# EasyEDA Pro project USB一拖四集线器.eprj

# Schematic USB集线器V1.0
Board Name: USB集线器V1.0; Create Date: 2025-10-13; Page Name: USB集线器V1.0; Project Name: 基于SL2.1A  USB一拖四集线器（已验证）; Schematic Name: USB集线器V1.0; Update Date: 2025-10-13; Company: 嘉立创EDA; Page Size: A4; Version: V1.0
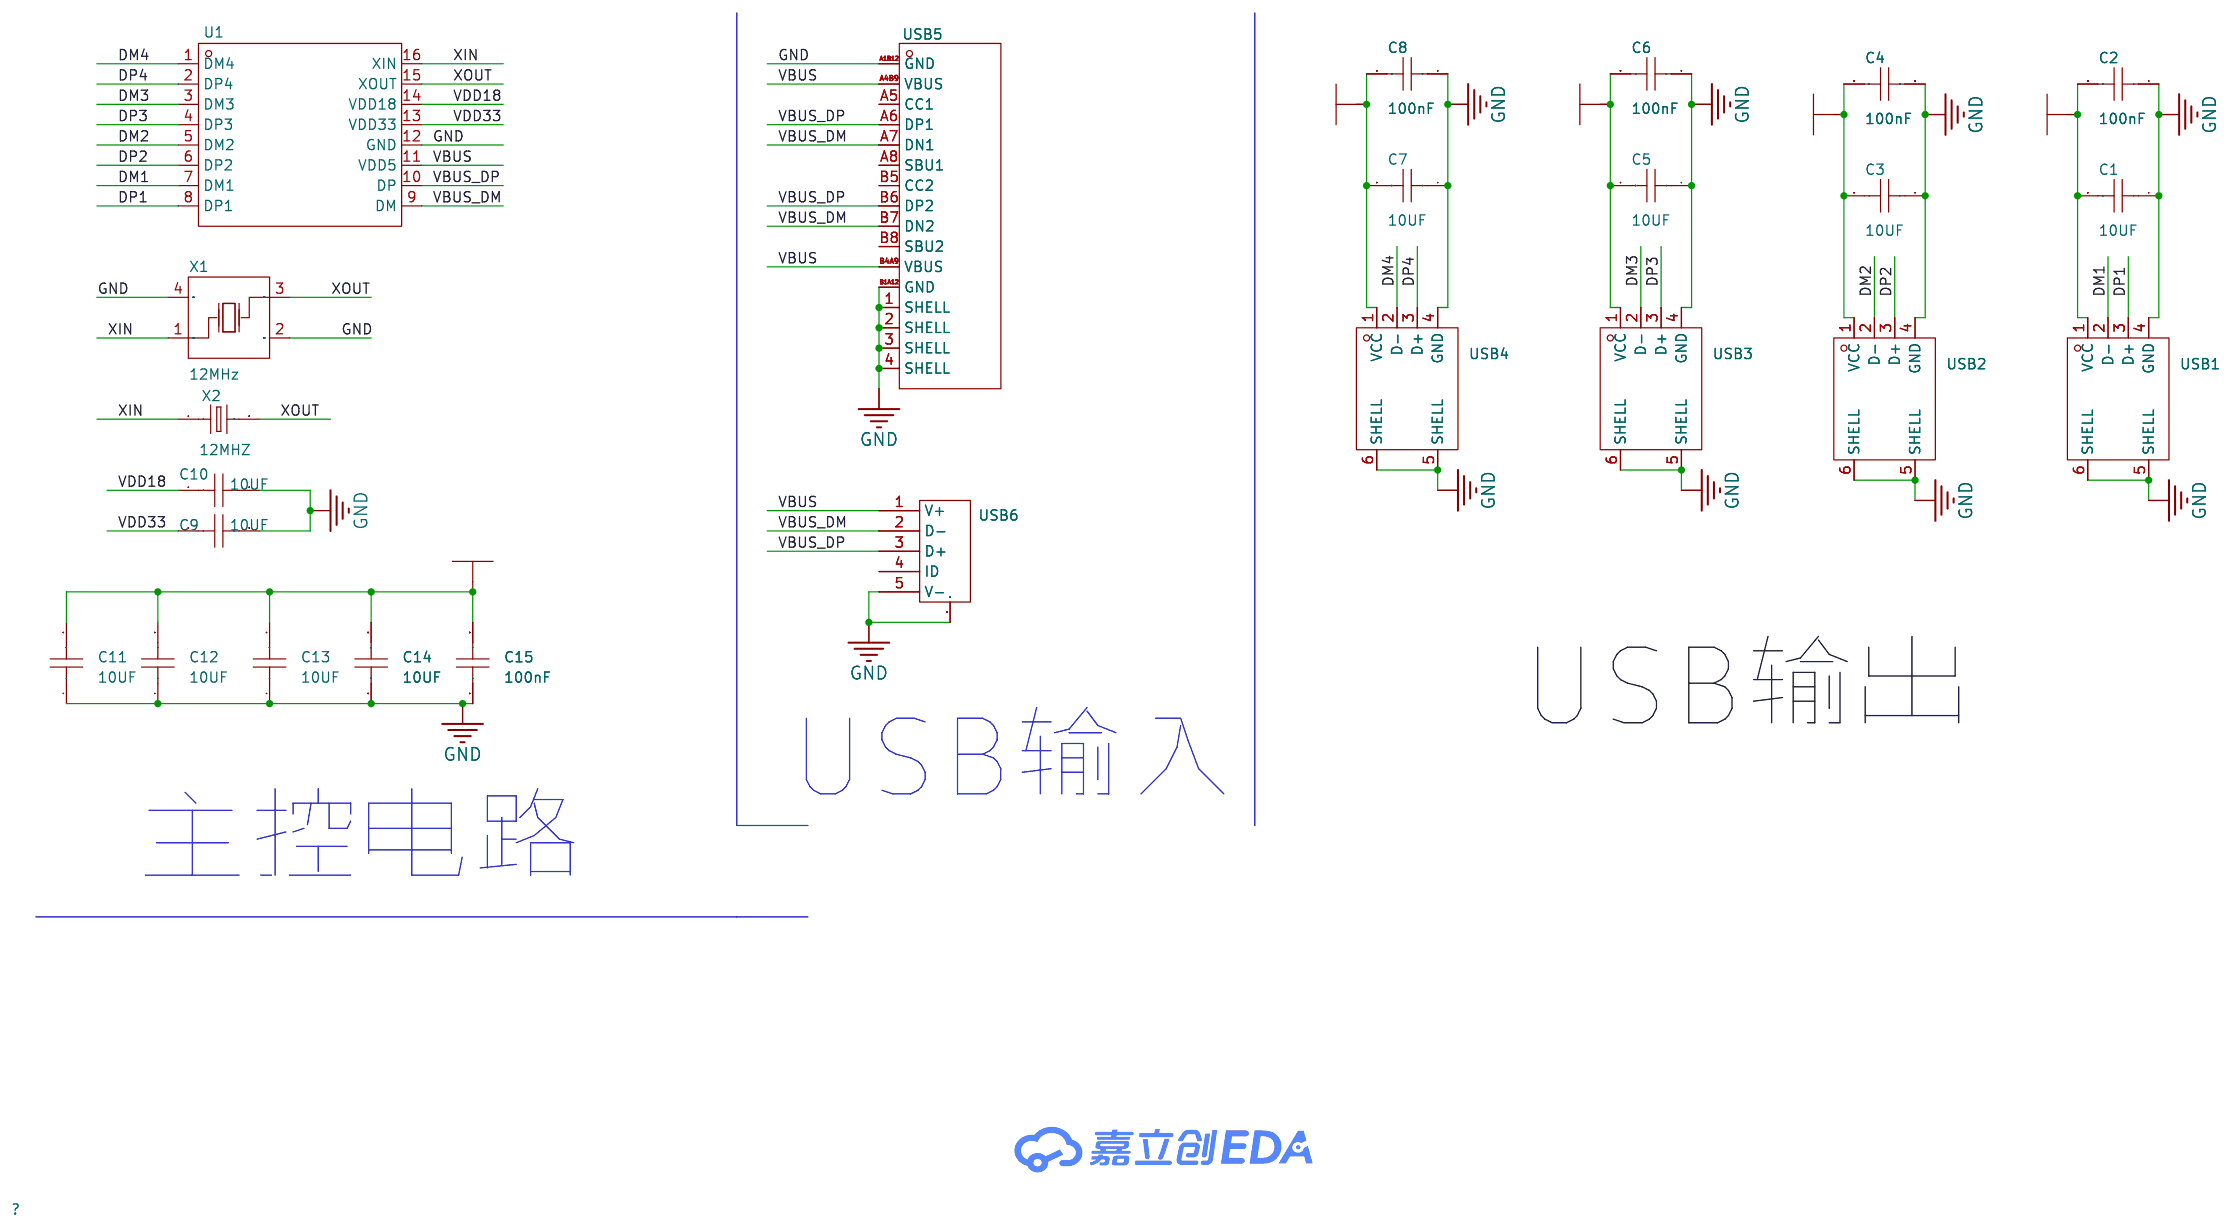
[diagram p0: schematic sheet]

## Parts
C1  10UF  [C0805]
C2  100nF  [C0805]
C3  10UF  [C0805]
C4  100nF  [C0805]
C5  10UF  [C0805]
C6  100nF  [C0805]
C7  10UF  [C0805]
C8  100nF  [C0805]
C9  10UF  [C0805]
C10  10UF  [C0805]
C11  10UF  [C0805]
C12  10UF  [C0805]
C13  10UF  [C0805]
C14  10UF  [C0805]
C15  100nF  [C0805]
U1  -  [SOP-16_L10.0-W3.9-P1.27-LS6.0-BL]
USB1  -  [USB-A-TH_916-362A1114Y10210]
USB2  -  [USB-A-TH_916-362A1114Y10210]
USB3  -  [USB-A-TH_916-362A1114Y10210]
USB4  -  [USB-A-TH_916-362A1114Y10210]
USB5  -  [USB-C-SMD_TYPE-C16PIN]
USB6  -  [MICRO-USB-SMD_5P-P0.65-H-F_C10418]
X1  12MHz  [OSC-SMD_4P-L3.2-W2.5-BL]
X2  12MHZ  [HC-49US_L11.5-W4.5-P4.88]

## Library data of the parts
C1-C15 = C_0805_US: 容值:100nF;精度:±10%;额定电压:50V;温度系数:X7R;; Supplier Footprint: 0805
U1 = SL2.1A: 类型:-;协议类别:-;驱动器/接收器数:-;数据速率:-;; Supplier Part: C192893; Manufacturer: CoreChips(和芯润德); Supplier Footprint: SOP-16_150mil; JLCPCB Part Class: Extended Part; Datasheet: https://atta.szlcsc.com/upload/public/pdf/source/20180522/C192893_624110D24898D57AAC785E3DF98EA862.pdf; Supplier: LCSC
USB1-USB4 = 916-362A1094Y10210: 连接器类型:Type-A;标准:USB 2.0;公母:母座;触点数量:4;端口数量:1;安装方式:直插;额定电流 - 电源:5A;工作温度范围:-55~+85;; LCSC Part Name: Type-A 母座 直插 大电流短体鱼叉脚无边铜壳PBT绿色; Supplier Part: C2763359; Manufacturer: 精拓金; Supplier Footprint: 插件; JLCPCB Part Class: Extended Part; Datasheet: https://atta.szlcsc.com/upload/public/pdf/source/20210526/C2763359_93EC42E46267681D1445F62B8B521E70.pdf; Supplier: LCSC; Connector Type: Type-A; Standard: USB 2.0; Gender: 母座; Number of Contacts: 4; Number of Ports: 1; Mounting Style: 直插; Current Rating - Power (Max): 5A; Operating Temperature Range: -55~+85
USB5 = TYPE-C16PIN: 连接器类型:Type-C;标准:-;公母:母座;触点数量:16;端口数量:1;安装方式:卧贴;额定电流 - 电源:3A;工作温度范围:-40~+85;; LCSC Part Name: Type-C 母座 卧贴 快充闪充 停产; Supplier Part: C393939; Manufacturer: SHOU HAN(首韩); Supplier Footprint: SMD; JLCPCB Part Class: Extended Part; Datasheet: https://atta.szlcsc.com/upload/public/pdf/source/20190521/C393939_7B9043D4CF1026AF443AB60D91FBCD5C.pdf; Supplier: LCSC; Connector Type: Type-C; Gender: 母座; Number of Contacts: 16; Number of Ports: 1; Mounting Style: 卧贴; Current Rating - Power (Max): 3A; Operating Temperature Range: -40~+85
USB6 = 920-E52A2021S10100: 连接器类型:Micro-B;标准:USB 2.0;公母:母座;触点数量:5;端口数量:1;额定电流 - 电源:1A;; LCSC Part Name: Micro-B 母座; Supplier Part: C10418; Manufacturer: 精拓金; Supplier Footprint: SMD; JLCPCB Part Class: Extended Part; Datasheet: https://atta.szlcsc.com/upload/public/pdf/source/20210305/C10418_4890444E73C7CF5EB311058F76E5ECA4.pdf; Supplier: LCSC; Connector Type: Micro-B; Standard: USB 2.0; Gender: 母座; Number of Contacts: 5; Number of Ports: 1; Current Rating - Power (Max): 1A
X1 = X322516MLB4SI: 晶振类型:贴片无源晶振;频率:16MHz;频率公差:±10ppm;频率稳定度:±30ppm;负载电容:9pF;工作温度:-40~+85;; LCSC Part Name: 16MHz ±10ppm 9pF; Supplier Part: C13738; Manufacturer: YXC扬兴科技; Supplier Footprint: SMD3225-4P; JLCPCB Part Class: Basic Part; Datasheet: https://atta.szlcsc.com/upload/public/pdf/source/20210329/C112971_1F611BDC486E193C1706F6D8EB5AA189.pdf; Supplier: LCSC; Crystal Type: 贴片无源晶振; Frequency Tolerance: ±10ppm; Frequency Stability: ±30ppm; Load Capacitance: 9pF; Operating Temperature: -40~+85
X2 = XIHCELNANF-12MHZ: 晶振类型:-;频率:-;频率公差:-;频率稳定度:-;负载电容:-;工作温度:-;; LCSC Part Name: 12MHZ 20PF30PPM -40~+85DIP; Supplier Part: C295072; Manufacturer: TAITIEN(泰艺电子); Supplier Footprint: HC-49S; JLCPCB Part Class: Extended Part; Datasheet: https://atta.szlcsc.com/upload/public/pdf/source/20180928/C295072_40A8829C49447BBE93E34C1F24014779.pdf; Supplier: LCSC

## Nets
GND: C1.1 C2.1 C3.1 C4.1 C5.1 C6.1 C7.1 C8.1 C9.2 C10.2 C11.1 C12.1 C13.1 C14.1 C15.1 U1.12(GND) USB1.4(GND) USB1.5(SHELL) USB1.6(SHELL) USB2.4(GND) USB2.5(SHELL) USB2.6(SHELL) USB3.4(GND) USB3.5(SHELL) USB3.6(SHELL) USB4.4(GND) USB4.5(SHELL) USB4.6(SHELL) USB5.1(SHELL) USB5.2(SHELL) USB5.3(SHELL) USB5.4(SHELL) USB5.A1B12(GND) USB5.B1A12(GND) USB6.0(MTN) USB6.5(V-) X1.2(GND) X1.4(GND)
VBUS: C1.2 C2.2 C3.2 C4.2 C5.2 C6.2 C7.2 C8.2 C11.2 C12.2 C13.2 C14.2 C15.2 U1.11(VDD5) USB1.1(VCC) USB2.1(VCC) USB3.1(VCC) USB4.1(VCC) USB5.A4B9(VBUS) USB5.B4A9(VBUS) USB6.1(V+)
VBUS_DM: U1.9(DM) USB5.A7(DN1) USB5.B7(DN2) USB6.2(D-)
VBUS_DP: U1.10(DP) USB5.A6(DP1) USB5.B6(DP2) USB6.3(D+)
VDD18: C10.1 U1.14(VDD18)
VDD33: C9.1 U1.13(VDD33)
DM1: U1.7(DM1) USB1.2(D-)
DM2: U1.5(DM2) USB2.2(D-)
DM3: U1.3(DM3) USB3.2(D-)
DM4: U1.1(DM4) USB4.2(D-)
DP1: U1.8(DP1) USB1.3(D+)
DP2: U1.6(DP2) USB2.3(D+)
DP3: U1.4(DP3) USB3.3(D+)
DP4: U1.2(DP4) USB4.3(D+)
XIN: U1.16(XIN) X1.1(OSC1) X2.1
XOUT: U1.15(XOUT) X1.3(OSC2) X2.2

Not connected (* = marked no-connect by the designer): USB5 A5(CC1) A8(SBU1) B5(CC2) B8(SBU2); USB6 4(ID)

## Notes on the sheet
- USB输出
- USB输入
- 主控电路

# Board USB集线器V1.0
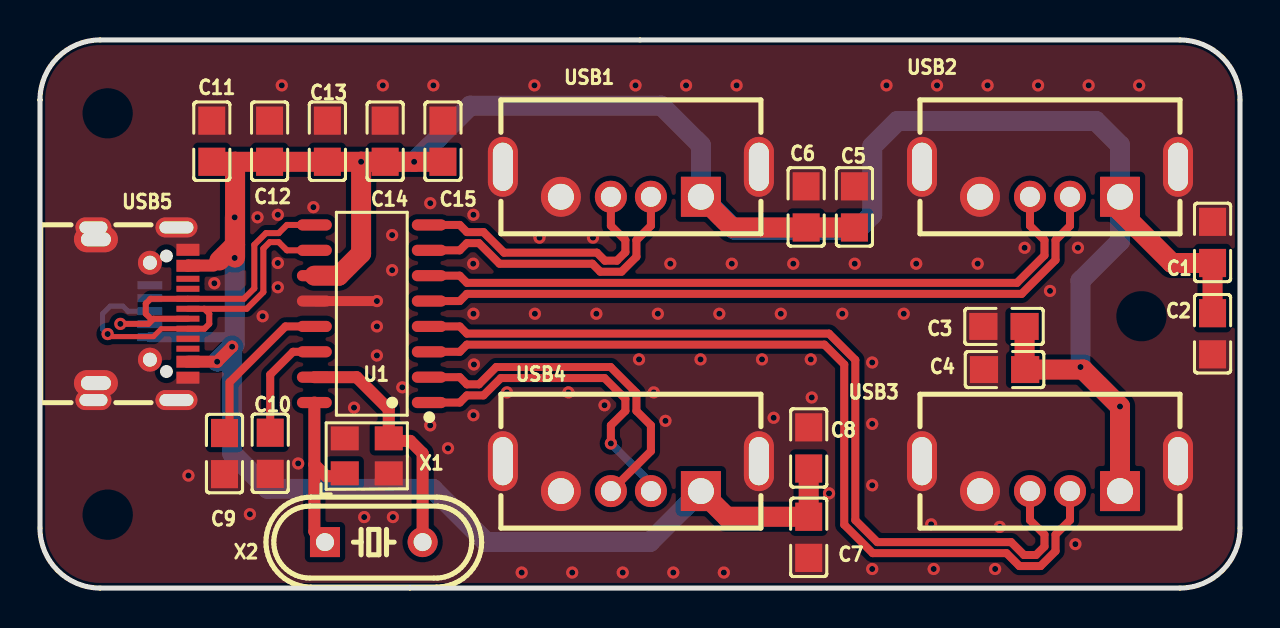
[diagram p1: board, top side]
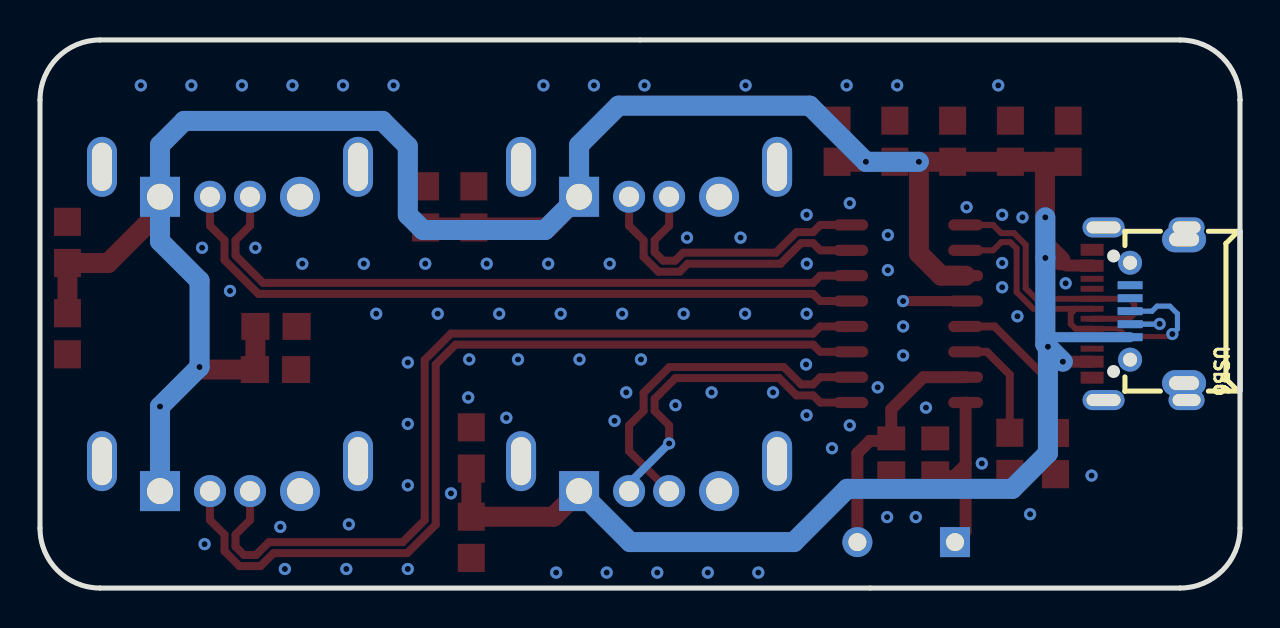
[diagram p2: board, bottom side, seen from below]

Outline 60 x 27.43 mm; copper layers: Top Layer, Bottom Layer. Coordinates in mm from the lower left corner of the outline.
Outline path: 0,3 0,24.43 arc(0.88,26.55) 3,27.43 57,27.43 arc(59.12,26.55) 60,24.43 60,3 arc(59.12,0.88) 57,0 3,0 arc(0.88,0.88) 0,3
Stack: Top Layer 0.035mm / Dielectric1 1.51mm FR4 er 4.5 / Bottom Layer 0.035mm

## Design rules (mm)
net DM4: DP4
net DP4: DP4
net DM3: DP3
net DP3: DP3
net DM2: DP2
net DP2: DP2
net DM1: DP1
net DP1: DP1
net XIN: DP6
net XOUT: DP6
net VBUS_DP: DP5
net VBUS_DM: DP5
spacing safeClearance (default): track to track 0.152, other pairs 0.152 to 0.3
track width trackWidth (default): min 0.127, default 0.254, max 2.54
differential pair differentialPair (default): width min 0.127, default 0.254, max 2.54; gap min 0.152, default 0.152
via viaSize (default): diameter min 0.5, default 0.61, max 10; hole min 0.3, default 0.305, max 6

## Placement (name value [footprint] x y rotation side)
C1  10UF  [C0805]  58.63 17.3 270 top
C2  100nF  [C0805]  58.63 12.73 90 top
C3  10UF  [C0805]  48.2 13.09 0 top
C4  100nF  [C0805]  48.23 10.94 0 top
C5  10UF  [C0805]  40.72 19.08 270 top
C6  100nF  [C0805]  38.31 19.08 270 top
C7  10UF  [C0805]  38.44 2.54 90 top
C8  100nF  [C0805]  38.44 7.01 270 top
C9  10UF  [C0805]  9.22 6.73 270 top
C10  10UF  [C0805]  11.51 6.74 270 top
C11  10UF  [C0805]  8.59 22.37 270 top
C12  10UF  [C0805]  11.48 22.37 270 top
C13  10UF  [C0805]  14.37 22.37 270 top
C14  10UF  [C0805]  17.26 22.37 270 top
C15  100nF  [C0805]  20.15 22.37 270 top
U1  -  [SOP-16_L10.0-W3.9-P1.27-LS6.0-BL]  16.59 13.73 90 top
USB1  -  [USB-A-TH_916-362A1114Y10210]  29.54 20.33 0 top
USB2  -  [USB-A-TH_916-362A1114Y10210]  50.5 20.33 0 top
USB3  -  [USB-A-TH_916-362A1114Y10210]  50.5 5.6 0 top
USB4  -  [USB-A-TH_916-362A1114Y10210]  29.54 5.6 0 top
USB5  -  [USB-C-SMD_TYPE-C16PIN]  5.03 13.73 270 top
USB6  -  [MICRO-USB-SMD_5P-P0.65-H-F_C10418]  4.14 13.86 90 bottom
X1  12MHz  [OSC-SMD_4P-L3.2-W2.5-BL]  16.34 6.62 0 top
X2  12MHZ  [HC-49US_L11.5-W4.5-P4.88]  16.69 2.3 0 top

## Footprints (pads in the part's own frame, mm; a bottom-side part is the same pattern mirrored in y, then rotated)
C0805
  rect 1.41x1.35 smd: 1(-1.03,0) 2(1.03,0)
HC-49US_L11.5-W4.5-P4.88
  rect 1.501x1.501 hole 0.899: 1(-2.441,0)
  round 1.501 hole 0.899: 2(2.441,0)
MICRO-USB-SMD_5P-P0.65-H-F_C10418
  oval 1.3x2.2 hole 0.701x1.501: 0(-3.599,-1.349) 0(3.599,-1.349)
  round 1.199 hole 0.701: 0(-2.425,1.351) 0(2.425,1.351)
  rect 0.399x1.25 smd: 1(-1.3,1.349) 2(-0.65,1.349) 3(0,1.349) 4(0.65,1.349) 5(1.3,1.349)
OSC-SMD_4P-L3.2-W2.5-BL
  rect 1.4x1.2 smd: 1(-1.1,-0.875) 2(1.1,-0.875) 3(1.1,0.875) 4(-1.1,0.875)
SOP-16_L10.0-W3.9-P1.27-LS6.0-BL
  oval 0.56x1.745 smd: 1(-4.445,-2.873) 2(-3.175,-2.873) 3(-1.905,-2.873) 4(-0.635,-2.873) 5(0.635,-2.873) 6(1.905,-2.873) 7(3.175,-2.873) 8(4.445,-2.873) 9(4.445,2.873) 10(3.175,2.873) 11(1.905,2.873) 12(0.635,2.873) 13(-0.635,2.873) 14(-1.905,2.873) 15(-3.175,2.873) 16(-4.445,2.873)
USB-A-TH_916-362A1114Y10210
  rect 1.999x1.999 hole 1.3: 1(3.5,-0.75)
  round 1.6 hole 1.001: 2(1.001,-0.75) 3(-1.001,-0.75)
  round 1.999 hole 1.3: 4(-3.5,-0.75)
  oval 1.501x2.999 hole 1.001x2.416: 5(6.401,0.75) 6(-6.401,0.75)
USB-C-SMD_TYPE-C16PIN
  oval 1.001x2.1 hole 0.6x1.7: 1(-4.321,1.788) 2(4.321,1.788)
  oval 1.001x1.801 hole 0.6x1.399: 3(-4.321,-2.362) 4(4.321,-2.362)
  rect 0.6x1.151 smd: A1B12(-3.2,2.362) A4B9(-2.401,2.362) B1A12(3.2,2.362) B4A9(2.401,2.362)
  rect 0.299x1.151 smd: A5(-1.25,2.362) A6(-0.249,2.362) A7(0.249,2.362) A8(-1.75,2.362) B5(1.75,2.362) B6(0.75,2.362) B7(-0.75,2.362) B8(1.25,2.362)

## Nets
As in the schematic.

Pads without a net: USB5 A5 A8 B5 B8; USB6 4

## Via types
v1: diameter 0.61, hole 0.305, Top Layer to Bottom Layer, 95 vias

## Routing (per net, layer and track width the routed paths; a pad name or vN(x,y) marks a point on that pad's centre or on a via; arc(x,y) is an arc through that point)
GND: length 3.1
  Top Layer w0.5: U1.12 v1(16.84,14.36)
  vias: v1(7.42,5.63) v1(8.72,15.25) v1(10.5,3.7) v1(10.88,18.56) v1(11.13,13.6) v1(11.89,18.68) v1(11.89,16.27) v1(11.89,15.05) v1(12.09,25.16) v1(12.91,6.24) v1(13.67,19.06) v1(15.7,9.03) v1(16.21,3.55) v1(16.84,13.09) v1(16.84,11.64) v1(17.14,25.16) v1(17.61,17.67) v1(17.61,15.91) v1(17.64,3.55) v1(18.11,10.05) v1(19.51,19.26) v1(19.51,8.14) v1(19.67,25.16) v1(20.4,7) v1(21.67,18.68) v1(21.66,16.23) v1(21.67,13.73) v1(21.67,8.65) v1(21.7,11.19) v1(23.35,9.79) v1(24.08,0.78) v1(24.72,25.16) v1(24.75,13.73) v1(24.97,17.54) v1(26.42,9.79) v1(26.61,0.78) v1(27.65,17.54) v1(27.82,13.73) v1(28.23,9.15) v1(29.14,0.78) v1(29.78,25.16) v1(29.95,11.44) v1(30.69,9.79) v1(30.89,13.73) v1(31.27,8.37) v1(31.52,16.23) v1(31.66,0.78) v1(32.3,25.16) v1(33.03,11.44) v1(33.97,13.73) v1(34.19,0.78) v1(34.59,16.23) v1(34.83,25.16) v1(36.1,11.44) v1(36.68,8.52) v1(37.04,13.73) v1(37.66,16.23) v1(38.54,11.44) v1(38.59,9.54) v1(39.45,4.74) v1(40.11,13.73) v1(40.74,16.23) v1(41.61,11.29) v1(41.61,8.22) v1(41.61,5.14) v1(41.61,0.95) v1(42.32,25.16) v1(43.19,13.73) v1(43.81,16.23) v1(44.56,3.19) v1(44.68,0.95) v1(44.85,25.16) v1(46.88,16.23) v1(47.38,25.16) v1(47.76,0.95) v1(47.99,3.06) v1(49.23,17.03) v1(49.9,25.16) v1(50.5,14.87) v1(51.77,2.2) v1(51.9,17.03) v1(52.43,25.16) v1(54.96,25.16)
VBUS: length 176.7
  Top Layer w0.6: 8.68,16.14 7.41,16.14 USB5.A4B9 ; v1(9.61,12.08) v1(8.86,11.33) USB5.B4A9
  Top Layer w1: v1(16.06,21.34) C13.2 C12.2 9.75,21.34 ; v1(16.06,21.34) C14.2 v1(18.71,21.34) C15.2 ; v1(16.06,21.34) 16.06,16.75 14.94,15.63 U1.11 ; C2.2 C1.2 56.6,16.27 54,18.87 USB2.1 ; C3.2 49.23,10.96 C4.2 52.15,10.94 v1(54,9.09) USB3.1 ; C11.2 9.75,21.34 ; 9.75,21.34 9.75,17.18 ; C8.2 C7.2 34.33,3.57 USB4.1 ; 9.75,16.54 9.75,17.18 ; 9.75,17.18 8.97,16.4 ; C5.2 C6.2 34.58,18.05 USB1.1
  Bottom Layer w0.5: 9.73,12.21 9.38,12.56 USB6.1
  Bottom Layer w1: USB4.1 30.49,2.3 22.31,2.3 19.64,4.97 11.38,4.97 9.61,6.74 v1(9.61,12.08) ; v1(9.61,12.08) 9.73,12.21 v1(9.73,16.52) v1(9.73,18.56) ; v1(9.61,12.08) v1(8.86,11.33) ; 33.04,19.63 33.04,22.17 31.07,24.14 21.51,24.14 v1(18.71,21.34) v1(16.06,21.34) ; 33.04,19.63 34.75,17.92 40.85,17.92 41.61,18.68 41.61,22.11 42.88,23.38 52.79,23.38 54,22.17 USB2.1 54,17.36 52.02,15.38 v1(52.02,11.06) v1(54,9.09) USB3.1 ; 33.04,19.63 USB1.1
VBUS_DM: length 17.7
  Top Layer w0.3: 3.89,13.22 v1(4.02,13.22) 5.41,13.22 5.67,13.48 USB5.A7 ; U1.9 12.34,18.17 11.94,17.77 11.3,17.77 10.72,17.18 10.72,15 10.19,14.48 USB5.B7 5.53,14.48 5.29,14.24 5.29,13.73 5.54,13.48
  Bottom Layer w0.254: 3.89,13.22 v1(4.02,13.22) 4.14,13.22 4.16,13.21 ; 3.89,13.22 3.91,13.21 ; 3.89,13.22 4.16,13.21 ; USB6.2 4.16,13.21
VBUS_DP: length 19.3
  Top Layer w0.254: v1(3.38,12.71) 3.51,12.59 5.67,12.59 6.06,12.98 USB5.B6
  Top Layer w0.3: 8.21,13.98 USB5.A6 ; 8.21,13.98 10.33,13.98 11.17,14.81 11.17,16.99 11.49,17.31 11.94,17.31 12.34,16.9 U1.10 ; 8.21,13.98 8.46,13.73 8.46,13.22 8.22,12.98 USB5.B6
  Bottom Layer w0.254: 3.26,12.71 v1(3.38,12.71) 3.13,12.97 3.13,13.73 3.51,14.11 4.14,14.11 4.4,13.86 USB6.3
VDD18: length 5.6
  Top Layer w0.4: C10.1 11.51,10.68 12.65,11.82 U1.14
VDD33: length 8
  Top Layer w0.4: U1.13 12.27,13.09 9.48,10.3 9.48,8.01 C9.1
DM1: length 14.7
  Top Layer w0.4: U1.7 20.99,16.9 21.35,17.26 21.95,17.26 22.97,16.23 27.61,16.23 28.02,15.83 29.07,15.83 29.82,16.58 29.82,17.41 30.55,18.13 USB1.2
DM2: length 35.6
  Top Layer w0.4: USB2.2 51.5,18.13 50.78,17.41 50.78,16.42 49.08,14.72 21.35,14.72 20.99,14.36 U1.5
DM3: length 44.4
  Top Layer w0.4: U1.3 20.99,11.82 21.35,12.18 39.22,12.18 40.21,11.19 40.21,3.17 41.63,1.75 48.32,1.75 48.97,1.1 50.03,1.1 50.78,1.85 50.78,2.68 51.5,3.4 USB3.2
DM4: length 16.5
  Top Layer w0.4: v1(28.54,7.24) 28.54,8.14 29.27,8.87 29.27,9.47 28.23,10.51 23.04,10.51 22.17,9.64 21.35,9.64 20.99,9.28 U1.1
  Bottom Layer w0.4: USB4.2 30.55,5.23 v1(28.54,7.24)
DP1: length 13.8
  Top Layer w0.4: U1.8 20.99,18.17 21.35,17.82 22.17,17.82 23.2,16.79 27.84,16.79 28.24,16.39 28.84,16.39 29.27,16.81 29.27,17.41 28.54,18.13 USB1.3
DP2: length 34.7
  Top Layer w0.4: USB2.3 49.5,18.13 50.22,17.41 50.22,16.65 48.85,15.28 21.35,15.28 20.99,15.63 U1.6
DP3: length 43.4
  Top Layer w0.4: USB3.3 49.5,3.4 50.22,2.68 50.22,2.08 49.8,1.65 49.2,1.65 48.55,2.3 41.86,2.3 40.77,3.4 40.77,11.42 39.45,12.73 21.35,12.73 20.99,13.09 U1.4
DP4: length 17.4
  Top Layer w0.4: USB4.3 30.55,6.85 30.55,8.14 29.82,8.87 29.82,9.77 28.53,11.06 22.81,11.06 21.95,10.2 21.35,10.2 20.99,10.55 U1.2
XIN: length 9
  Top Layer w0.6: U1.16 13.72,6.19 ; 13.72,6.19 14.31,5.6 15.22,5.6 15.24,5.62 ; 13.72,6.19 13.72,2.83 X2.1
XOUT: length 12.4
  Top Layer w0.6: U1.15 15.83,10.55 17.44,8.95 17.44,7.37 18.51,7.37 19.13,6.74 X2.2

## Copper pours and planes (outline as drawn; the poured copper is in the pictures)
GND on Top Layer: -0.05,27.57 60.03,27.57 60.03,-0.62 -0.05,-0.62
